# EasyEDA Pro project I2S_XLR_Adapter.eprj, schematic P1

## Sheets
1 DAC_XLR: Board Name: Board1; Create Date: 2026-01-31; Page Name: DAC_XLR; Project Name: I2S_XLR_Adapter; Schematic Name: P1; Update Date: 2026-05-29; Company: EasyEDA.com; Page Size: A4; Version: V1.0
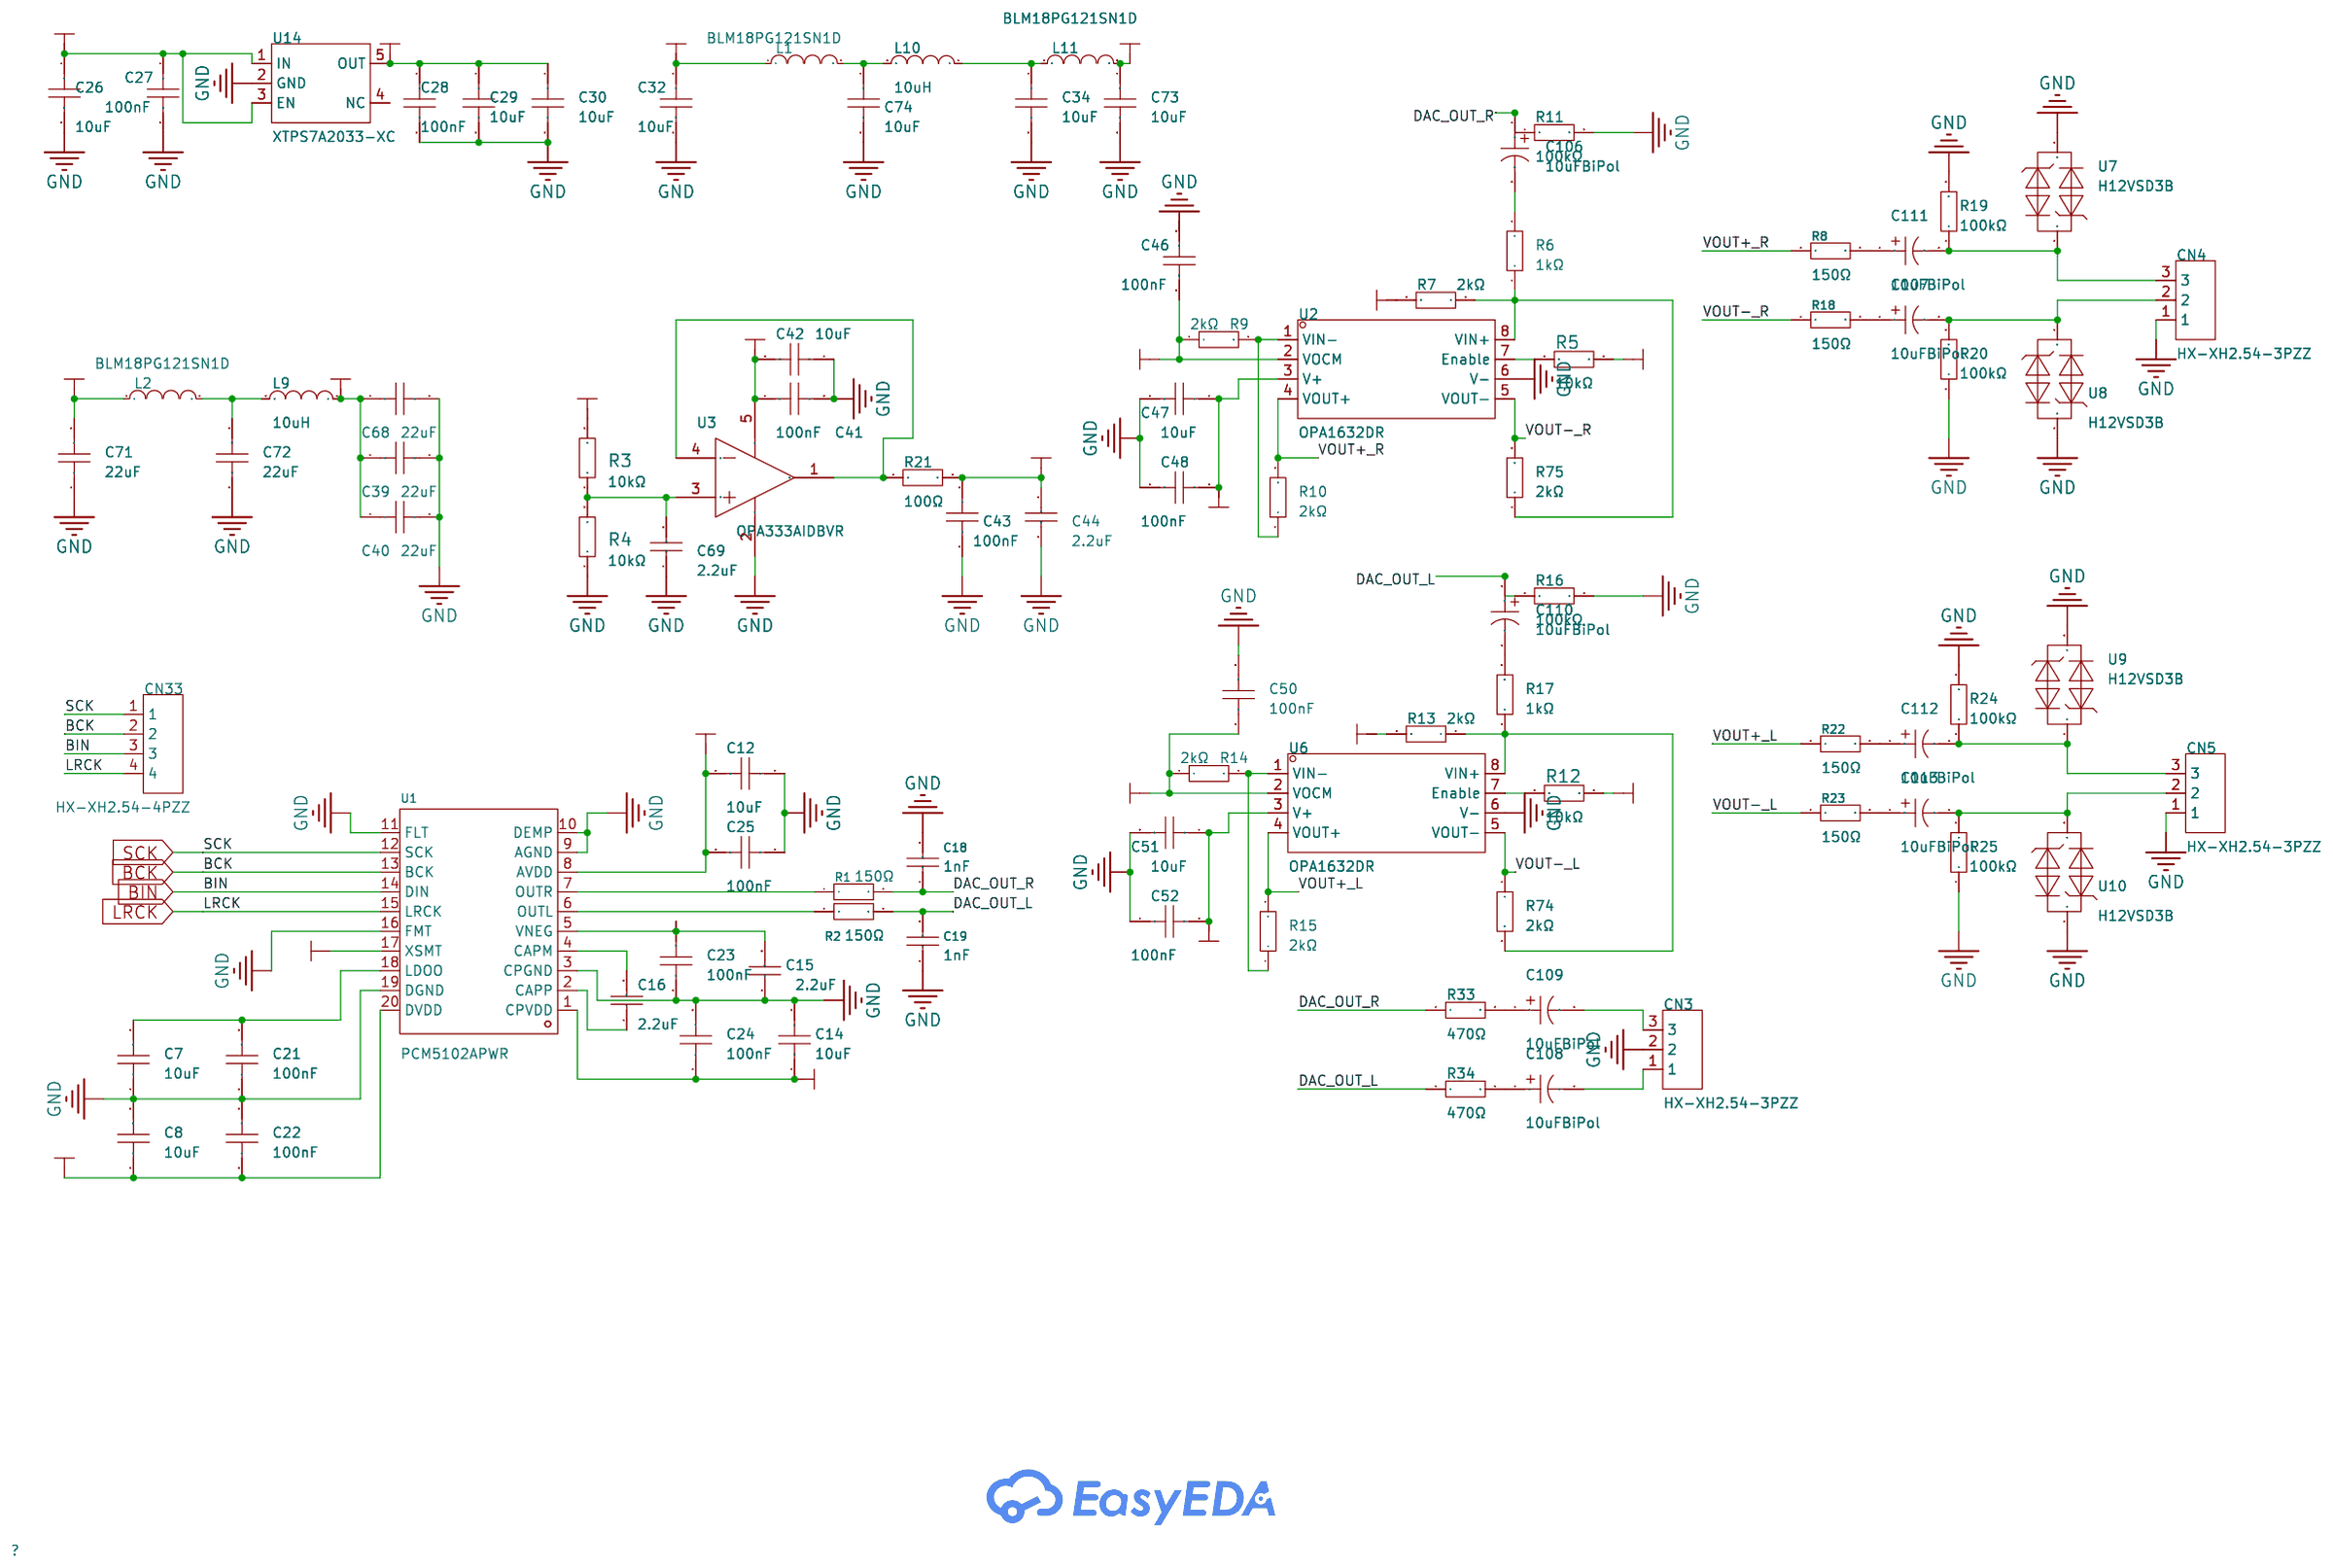
[diagram p0: DAC_XLR]
2 Power: Page Name: Power; Update Date: 2026-05-06
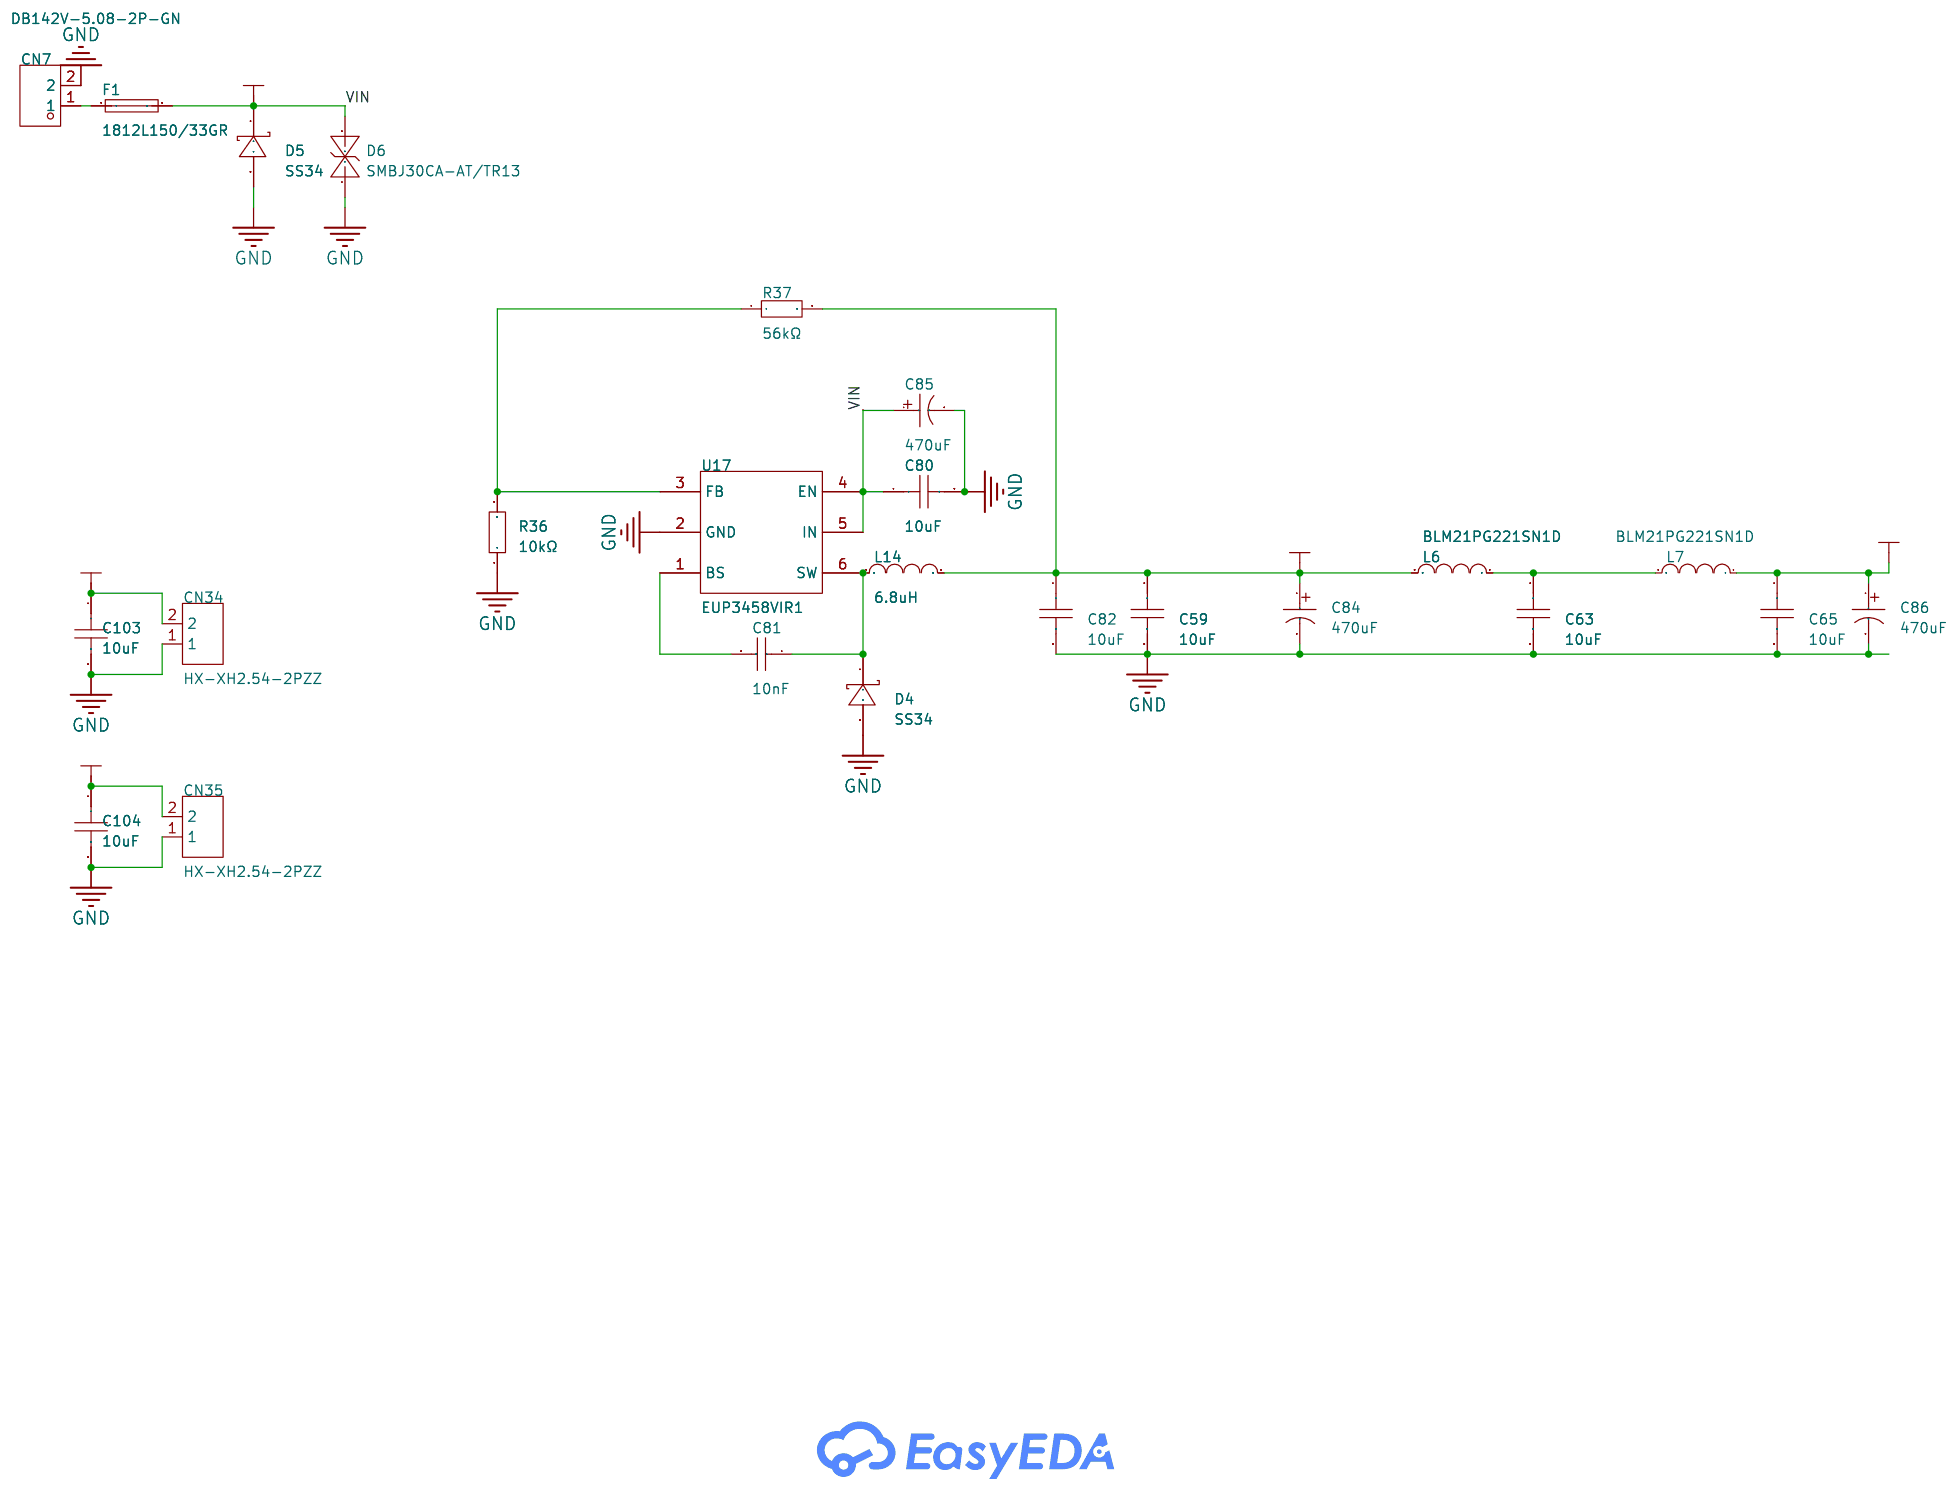
[diagram p1: Power]
3 MIDI: Create Date: 2026-02-01; Page Name: MIDI; Update Date: 2026-02-03
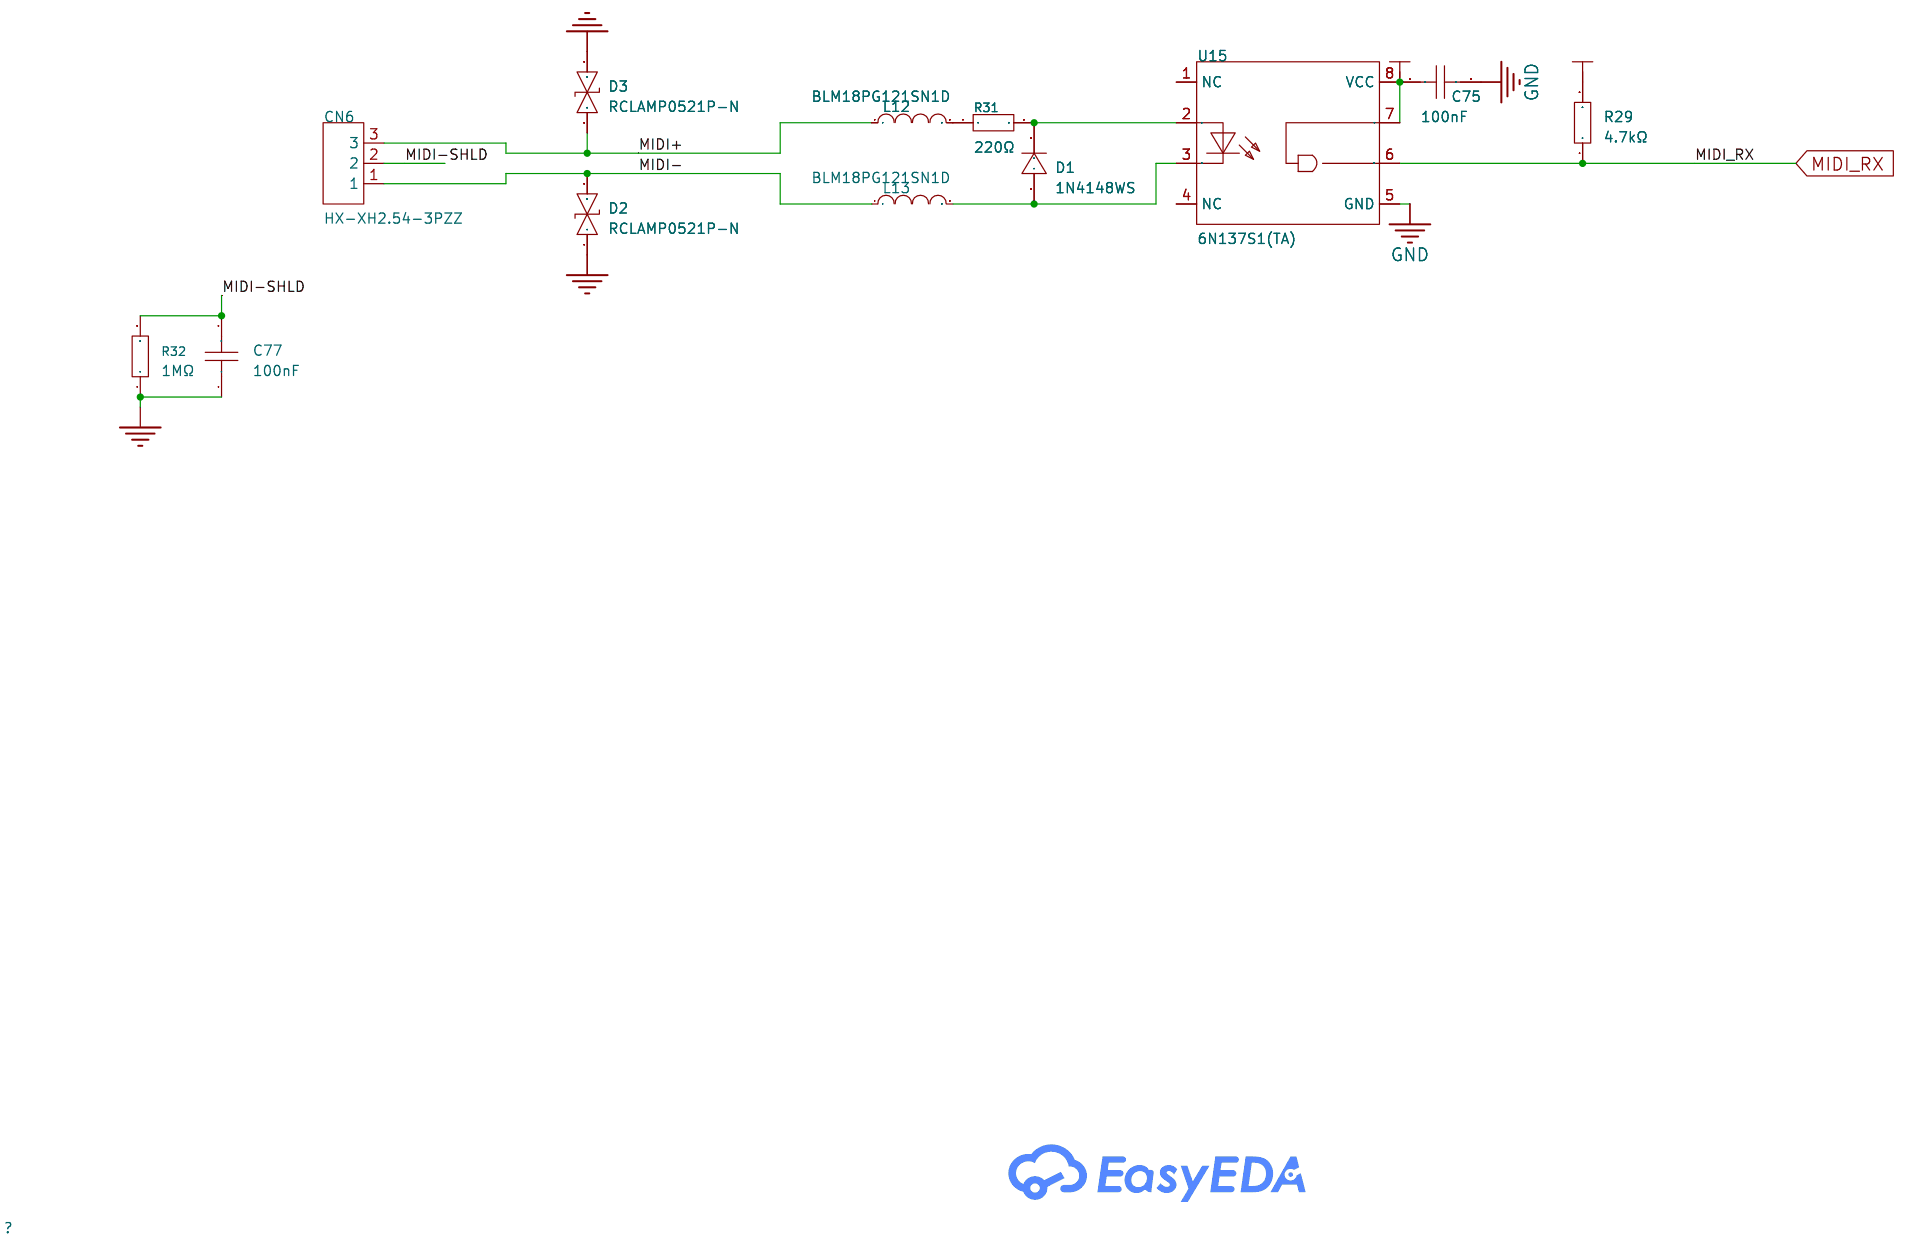
[diagram p2: MIDI]
4 ESP32: Create Date: 2026-05-05; Page Name: ESP32
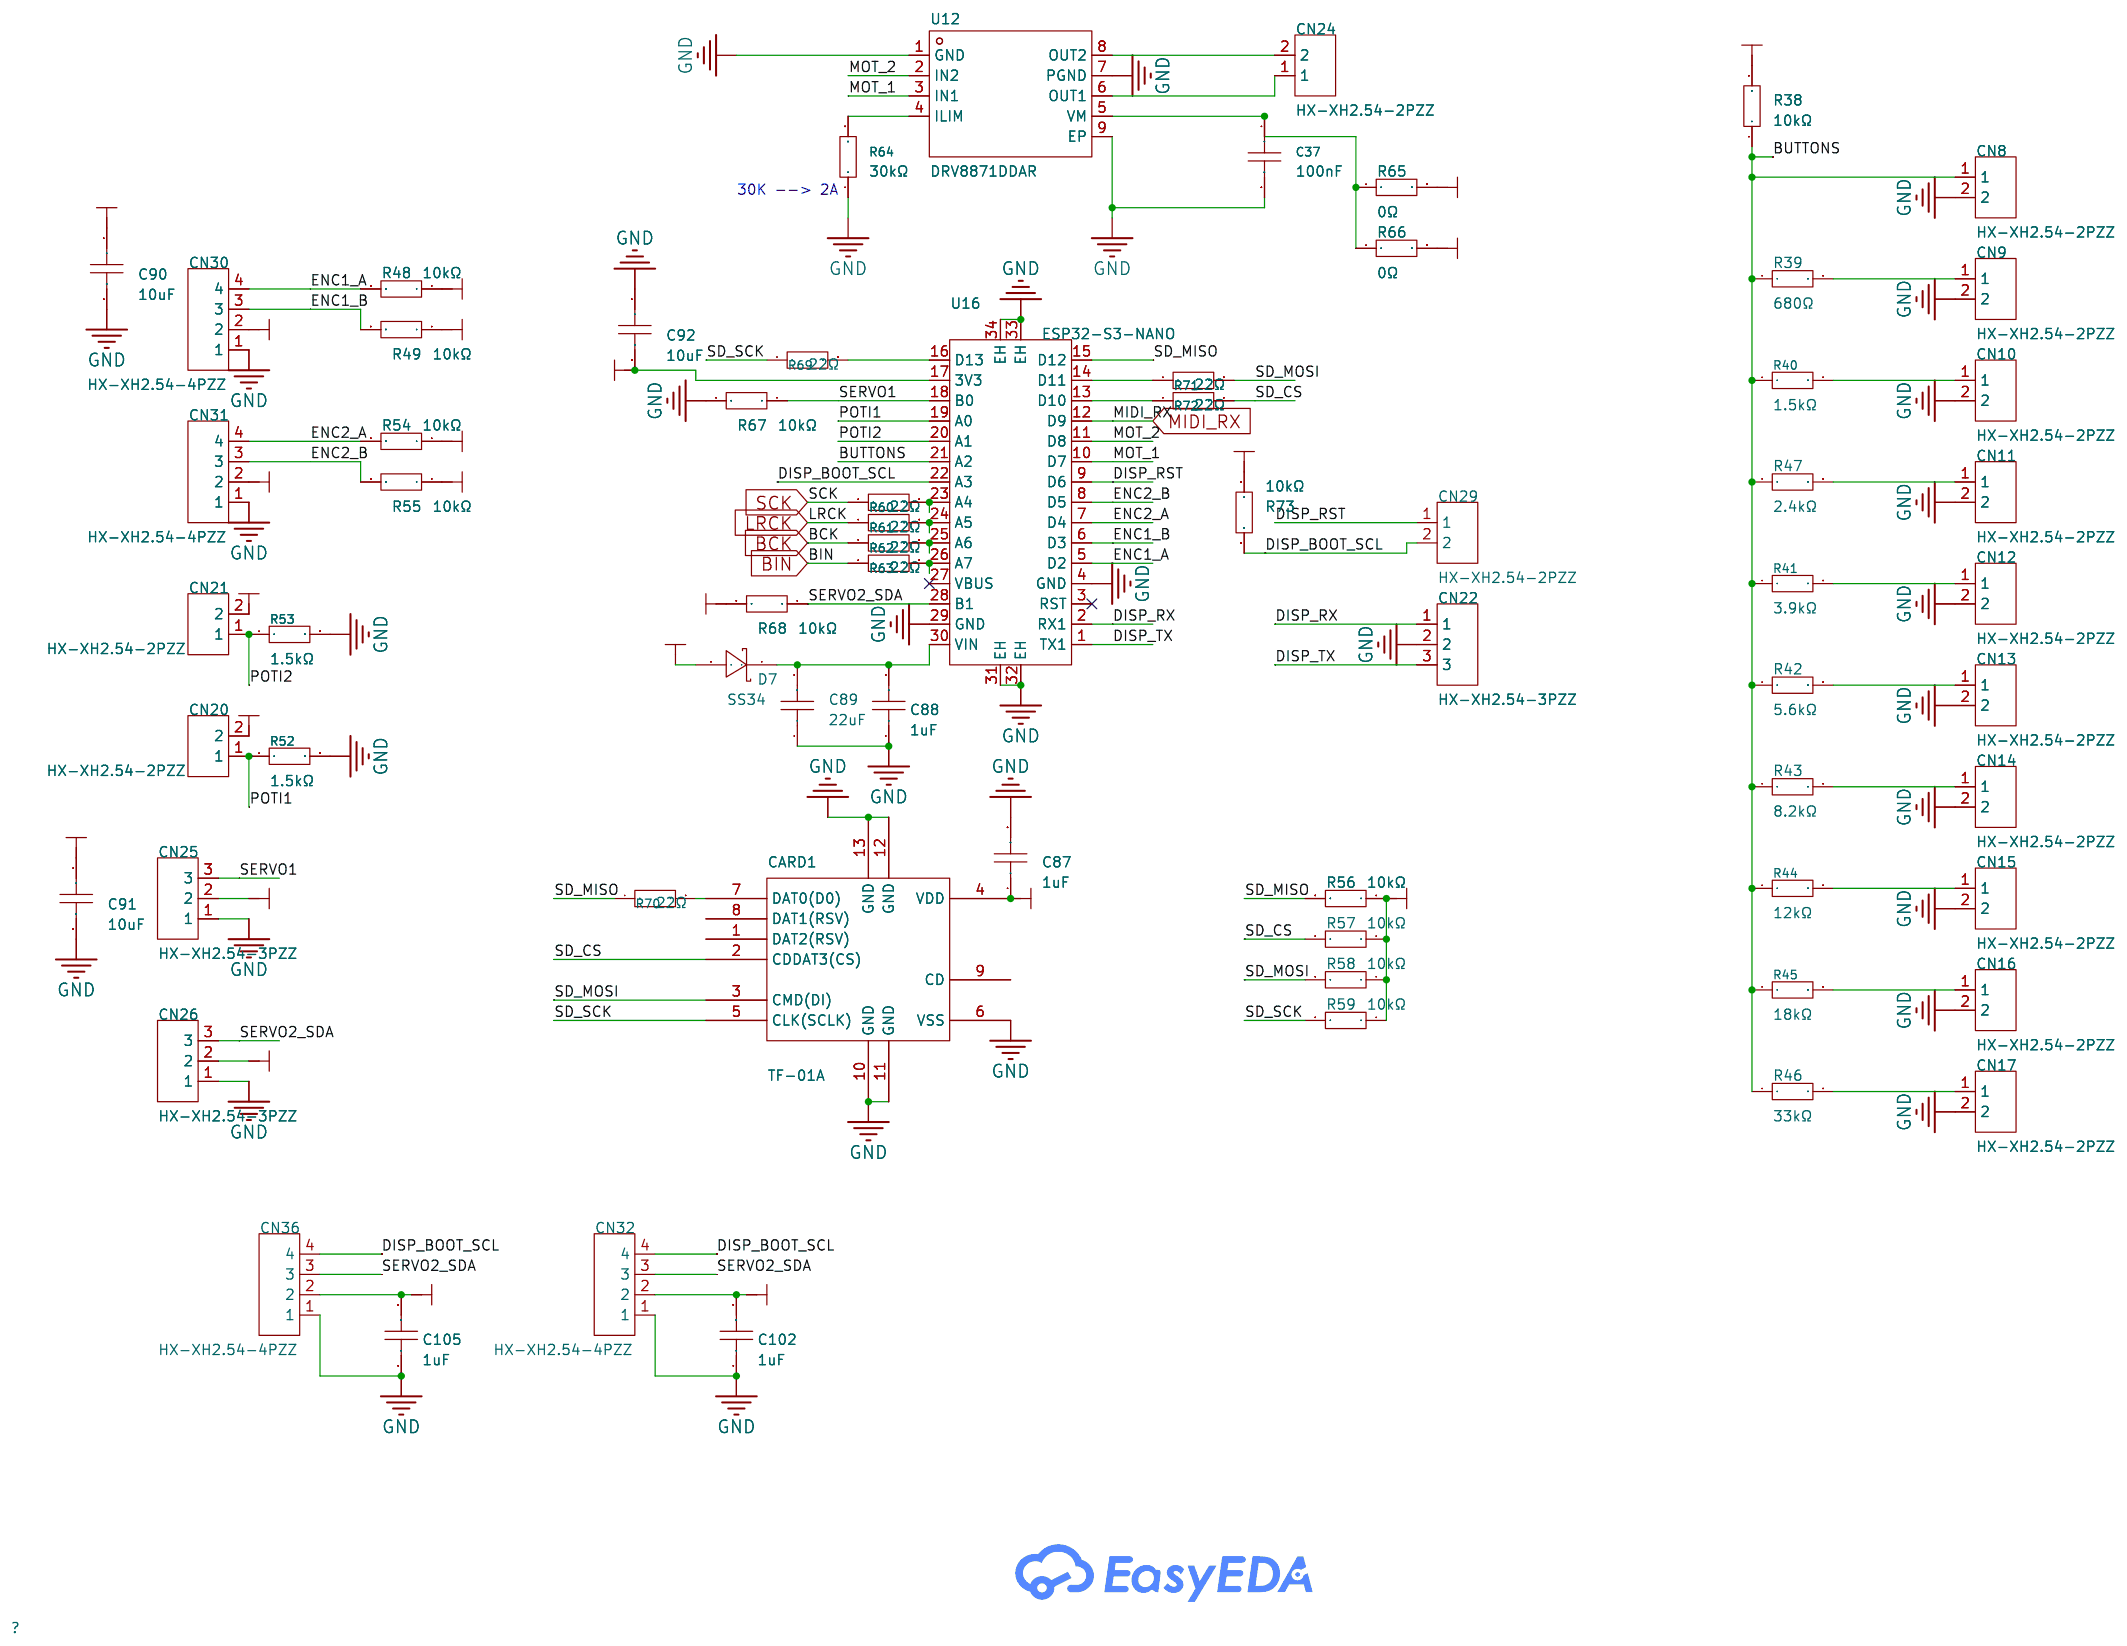
[diagram p3: ESP32]

## Parts
sheet DAC_XLR
C7  10uF  [C0805]
C8  10uF  [C0805]
C12  10uF  [C0805]
C14  10uF  [C0805]
C15  2.2uF  [C1206]
C16  2.2uF  [C1206]
C18  1nF  [C0603]
C19  1nF  [C0603]
C21  100nF  [C0402]
C22  100nF  [C0402]
C23  100nF  [C0402]
C24  100nF  [C0402]
C25  100nF  [C0402]
C26  10uF  [C0805]
C27  100nF  [C0402]
C28  100nF  [C0402]
C29  10uF  [C0805]
C30  10uF  [C0805]
C32  10uF  [C0805]
C34  10uF  [C0805]
C39  22uF  [C0805]
C40  22uF  [C0805]
C41  100nF  [C0402]
C42  10uF  [C0805]
C43  100nF  [C0402]
C44  2.2uF  [C1206]
C46  100nF  [C0402]
C47  10uF  [C0805]
C48  100nF  [C0402]
C50  100nF  [C0402]
C51  10uF  [C0805]
C52  100nF  [C0402]
C68  22uF  [C0805]
C69  2.2uF  [C1206]
C71  22uF  [C0805]
C72  22uF  [C0805]
C73  10uF  [C0805]
C74  10uF  [C0805]
C106  10uFBiPol  [CAP-TH_BD8.0-P3.50-D0.6-FD_1]  (no BOM)
C107  10uFBiPol  [CAP-TH_BD8.0-P3.50-D0.6-FD_1]  (no BOM)
C108  10uFBiPol  [CAP-TH_BD8.0-P3.50-D0.6-FD_1]  (no BOM)
C109  10uFBiPol  [CAP-TH_BD8.0-P3.50-D0.6-FD_1]  (no BOM)
C110  10uFBiPol  [CAP-TH_BD8.0-P3.50-D0.6-FD_1]  (no BOM)
C111  10uFBiPol  [CAP-TH_BD8.0-P3.50-D0.6-FD_1]  (no BOM)
C112  10uFBiPol  [CAP-TH_BD8.0-P3.50-D0.6-FD_1]  (no BOM)
C113  10uFBiPol  [CAP-TH_BD8.0-P3.50-D0.6-FD_1]  (no BOM)
CN3  HX-XH2.54-3PZZ  [CONN-TH_3P-P2.50_HC-XH-3A-G]
CN4  HX-XH2.54-3PZZ  [CONN-TH_3P-P2.50_HC-XH-3A-G]
CN5  HX-XH2.54-3PZZ  [CONN-TH_3P-P2.50_HC-XH-3A-G]
CN33  HX-XH2.54-4PZZ  [CONN-TH_4P-P2.50-XH2.54-4P]
L1  BLM18PG121SN1D  [L0603]
L2  BLM18PG121SN1D  [L0603]
L9  10uH  [IND-SMD_L2.5-W2.0]
L10  10uH  [IND-SMD_L2.5-W2.0]
L11  BLM18PG121SN1D  [L0603]
R1  150Ω  [R0603]
R2  150Ω  [R0603]
R3  10kΩ  [R0603]
R4  10kΩ  [R0603]
R5  10kΩ  [R0603]
R6  1kΩ  [R0603]
R7  2kΩ  [R0603]
R8  150Ω  [R0603]
R9  2kΩ  [R0603]
R10  2kΩ  [R0603]
R11  100kΩ  [R0603]
R12  10kΩ  [R0603]
R13  2kΩ  [R0603]
R14  2kΩ  [R0603]
R15  2kΩ  [R0603]
R16  100kΩ  [R0603]
R17  1kΩ  [R0603]
R18  150Ω  [R0603]
R19  100kΩ  [R0603]
R20  100kΩ  [R0603]
R21  100Ω  [R0402]
R22  150Ω  [R0603]
R23  150Ω  [R0603]
R24  100kΩ  [R0603]
R25  100kΩ  [R0603]
R33  470Ω  [R0603]
R34  470Ω  [R0603]
R74  2kΩ  [R0603]
R75  2kΩ  [R0603]
U1  PCM5102APWR  [TSSOP-20_L6.5-W4.4-P0.65-LS6.4-BL]
U2  OPA1632DR  [SOIC-8_L4.9-W3.9-P1.27-LS6.0-BL]
U3  OPA333AIDBVR  [SOT-23-5_L3.0-W1.7-P0.95-LS2.8-BR]
U6  OPA1632DR  [SOIC-8_L4.9-W3.9-P1.27-LS6.0-BL]
U7  H12VSD3B  [SOD-323_L1.8-W1.3-LS2.7-BI]
U8  H12VSD3B  [SOD-323_L1.8-W1.3-LS2.7-BI]
U9  H12VSD3B  [SOD-323_L1.8-W1.3-LS2.7-BI]
U10  H12VSD3B  [SOD-323_L1.8-W1.3-LS2.7-BI]
U14  XTPS7A2033-XC  [SOT-23-5_L3.0-W1.7-P0.95-LS2.8-BL]
sheet ESP32
C37  100nF  [C0603]
C87  1uF  [C0402]
C88  1uF  [C0402]
C89  22uF  [C0805]
C90  10uF  [C0805]
C91  10uF  [C0805]
C92  10uF  [C0805]
C102  1uF  [C0402]
C105  1uF  [C0402]
CARD1  TF-01A  [TF-SMD_TF-01A]
CN8  HX-XH2.54-2PZZ  [CONN-TH_2P-P2.50_HX-2.54MM-2P-ZZ-MS]
CN9  HX-XH2.54-2PZZ  [CONN-TH_2P-P2.50_HX-2.54MM-2P-ZZ-MS]
CN10  HX-XH2.54-2PZZ  [CONN-TH_2P-P2.50_HX-2.54MM-2P-ZZ-MS]
CN11  HX-XH2.54-2PZZ  [CONN-TH_2P-P2.50_HX-2.54MM-2P-ZZ-MS]
CN12  HX-XH2.54-2PZZ  [CONN-TH_2P-P2.50_HX-2.54MM-2P-ZZ-MS]
CN13  HX-XH2.54-2PZZ  [CONN-TH_2P-P2.50_HX-2.54MM-2P-ZZ-MS]
CN14  HX-XH2.54-2PZZ  [CONN-TH_2P-P2.50_HX-2.54MM-2P-ZZ-MS]
CN15  HX-XH2.54-2PZZ  [CONN-TH_2P-P2.50_HX-2.54MM-2P-ZZ-MS]
CN16  HX-XH2.54-2PZZ  [CONN-TH_2P-P2.50_HX-2.54MM-2P-ZZ-MS]
CN17  HX-XH2.54-2PZZ  [CONN-TH_2P-P2.50_HX-2.54MM-2P-ZZ-MS]
CN20  HX-XH2.54-2PZZ  [CONN-TH_2P-P2.50_HX-2.54MM-2P-ZZ-MS]
CN21  HX-XH2.54-2PZZ  [CONN-TH_2P-P2.50_HX-2.54MM-2P-ZZ-MS]
CN22  HX-XH2.54-3PZZ  [CONN-TH_3P-P2.50_HC-XH-3A-G]
CN24  HX-XH2.54-2PZZ  [CONN-TH_2P-P2.50_HX-2.54MM-2P-ZZ-MS]
CN25  HX-XH2.54-3PZZ  [CONN-TH_3P-P2.50_HC-XH-3A-G]
CN26  HX-XH2.54-3PZZ  [CONN-TH_3P-P2.50_HC-XH-3A-G]
CN29  HX-XH2.54-2PZZ  [CONN-TH_2P-P2.50_HX-2.54MM-2P-ZZ-MS]
CN30  HX-XH2.54-4PZZ  [CONN-TH_4P-P2.50-XH2.54-4P]
CN31  HX-XH2.54-4PZZ  [CONN-TH_4P-P2.50-XH2.54-4P]
CN32  HX-XH2.54-4PZZ  [CONN-TH_4P-P2.50-XH2.54-4P]
CN36  HX-XH2.54-4PZZ  [CONN-TH_4P-P2.50-XH2.54-4P]
D7  SS34  [SMA_L4.3-W2.6-LS5.2-RD]
R38  10kΩ  [R0402]
R39  680Ω  [R0402]
R40  1.5kΩ  [R0402]
R41  3.9kΩ  [R0402]
R42  5.6kΩ  [R0402]
R43  8.2kΩ  [R0402]
R44  12kΩ  [R0402]
R45  18kΩ  [R0402]
R46  33kΩ  [R0402]
R47  2.4kΩ  [R0402]
R48  10kΩ  [R0402]
R49  10kΩ  [R0402]
R52  1.5kΩ  [R0402]
R53  1.5kΩ  [R0402]
R54  10kΩ  [R0402]
R55  10kΩ  [R0402]
R56  10kΩ  [R0402]
R57  10kΩ  [R0402]
R58  10kΩ  [R0402]
R59  10kΩ  [R0402]
R60  22Ω  [R0402]
R61  22Ω  [R0402]
R62  22Ω  [R0402]
R63  22Ω  [R0402]
R64  30kΩ  [R0603]
R65  0Ω  [R0805]
R66  0Ω  [R0805]  (no BOM)
R67  10kΩ  [R0402]
R68  10kΩ  [R0402]
R69  22Ω  [R0402]
R70  22Ω  [R0402]
R71  22Ω  [R0402]
R72  22Ω  [R0402]
R73  10kΩ  [R0402]
U12  DRV8871DDAR  [SO-8_L4.9-W3.9-P1.27-LS6.0-BL-EP]
U16  ESP32-S3-NANO  [COMM-TH_43.2-W17.8-P2.54_ESP32-S3]
sheet MIDI
C75  100nF  [C0402]
C77  100nF  [C0402]
CN6  HX-XH2.54-3PZZ  [CONN-TH_3P-P2.50_HC-XH-3A-G]
D1  1N4148WS  [SOD-323_L1.8-W1.3-LS2.5-RD]
D2  RCLAMP0521P-N  [X1-DFN1006-2_L1.0-W0.6-P0.65-BI]
D3  RCLAMP0521P-N  [X1-DFN1006-2_L1.0-W0.6-P0.65-BI]
L12  BLM18PG121SN1D  [L0603]
L13  BLM18PG121SN1D  [L0603]
R29  4.7kΩ  [R0603]
R31  220Ω  [R0603]
R32  1MΩ  [R0603]
U15  6N137S1(TA)  [SMD-8_L9.8-W6.6-P2.54-LS10.3-BL]
sheet Power
C59  10uF  [C0805]
C63  10uF  [C0805]
C65  10uF  [C0805]
C80  10uF  [C0805]
C81  10nF  [C0402]
C82  10uF  [C0805]
C84  470uF  [CAP-TH_BD10.0-P5.00-D1.0-FD]
C85  470uF  [CAP-TH_BD10.0-P5.00-D1.0-FD]
C86  470uF  [CAP-TH_BD10.0-P5.00-D1.0-FD]
C103  10uF  [C0805]
C104  10uF  [C0805]
CN7  DB142V-5.08-2P-GN  [CONN-TH_2P-P5.08_DIBO_DB142V-5.08-2P]
CN34  HX-XH2.54-2PZZ  [CONN-TH_2P-P2.50_HX-2.54MM-2P-ZZ-MS]
CN35  HX-XH2.54-2PZZ  [CONN-TH_2P-P2.50_HX-2.54MM-2P-ZZ-MS]
D4  SS34  [SMA_L4.3-W2.6-LS5.2-RD]
D5  SS34  [SMA_L4.3-W2.6-LS5.2-RD]
D6  SMBJ30CA-AT/TR13  [SMB_L4.3-W3.6-LS5.4-BI]
F1  1812L150/33GR  [F1812]
L6  BLM21PG221SN1D  [L0805]
L7  BLM21PG221SN1D  [L0805]
L14  6.8uH  [IND-SMD_L7.0-W6.6]
R36  10kΩ  [R0402]
R37  56kΩ  [R0402]
U17  EUP3458VIR1  [SOT-23-6_L2.9-W1.6-P0.95-LS2.8-BL]

## Library data of the parts
C7 C8 C12 C14 C26 C29 C30 C32 C34 C42 C47 C51 C59 C63 C65 C73 C74 C80 C82 C90-C92 C103 C104 = CL21A106KAYNNNE_C15850: LCSC Part Name: 10uF ±10% 25V; Supplier Part: C15850; Manufacturer: SAMSUNG(三星); Manufacturer Part: CL21A106KAYNNNE; Supplier Footprint: 0805; JLCPCB Part Class: Basic Part; Datasheet: https://item.szlcsc.com/datasheet/CL21A106KAYNNNE/16532.html; Supplier: LCSC; Tolerance: ±10%; Voltage Rating: 25V; Temperature Coefficient: X5R
C15 C16 C44 C69 = CL31B225KBHNNNE: LCSC Part Name: 2.2uF ±10% 50V; Supplier Part: C50254; Manufacturer: SAMSUNG(三星); Supplier Footprint: 1206; JLCPCB Part Class: Basic Part; Datasheet: https://item.szlcsc.com/datasheet/CL31B225KBHNNNE/51263.html; Supplier: LCSC; Tolerance: ±10%; Voltage Rating: 50V; Temperature Coefficient: X7R
C18 C19 = CL10B102KB8NNNC: LCSC Part Name: 1nF ±10% 50V; Supplier Part: C1588; Manufacturer: SAMSUNG(三星); Supplier Footprint: 0603; JLCPCB Part Class: Basic Part; Datasheet: https://item.szlcsc.com/datasheet/CL10B102KB8NNNC/1940.html; Supplier: LCSC; Tolerance: ±10%; Voltage Rating: 50V; Temperature Coefficient: X7R
C21-C25 C27 C28 C41 C43 C46 C48 C50 C52 C75 C77 = CL05B104KB54PNC: LCSC Part Name: 100nF ±10% 50V; Supplier Part: C307331; Manufacturer: SAMSUNG(三星); Supplier Footprint: 0402; JLCPCB Part Class: Basic Part; Datasheet: https://item.szlcsc.com/datasheet/CL05B104KB54PNC/291005.html; Supplier: LCSC; Tolerance: ±10%; Voltage Rating: 50V; Temperature Coefficient: X7R
C39 C40 C68 C71 C72 C89 = CL21A226MAQNNNE: LCSC Part Name: 22uF ±20% 25V; Supplier Part: C45783; Manufacturer: SAMSUNG(三星); Supplier Footprint: 0805; JLCPCB Part Class: Basic Part; Datasheet: https://item.szlcsc.com/datasheet/CL21A226MAQNNNE/46786.html; Supplier: LCSC; Tolerance: ±20%; Voltage Rating: 25V; Temperature Coefficient: X5R
C106-C113 = UES1C470MPM: LCSC Part Name: 47uF ±20% 16V; Supplier Part: C1669286; Manufacturer: Nichicon(尼吉康); Supplier Footprint: 插件,D8xL11.5mm; JLCPCB Part Class: Extended Part; Datasheet: https://item.szlcsc.com/datasheet/UES1C470MPM/1760135.html; Supplier: LCSC; Tolerance: ±20%; Voltage Rating: 16V; Pin Spacing: 3.5mm; Diameter: 8mm; Height - Seated (Max): 11.5mm; Polarity type: 无极性
CN3-CN6 CN22 CN25 CN26 = HX-XH2.54-3PZZ: LCSC Part Name: 1x3P 间距:2.54mm 直插 系列:XH; Supplier Part: C42391661; Manufacturer: hanxia(韩下); Supplier Footprint: 插件,P=2.5mm; JLCPCB Part Class: Extended Part; Datasheet: https://item.szlcsc.com/datasheet/HX-XH2.54-3PZZ/44326933.html; Supplier: LCSC; Pins Structure: 1x3P; Pitch: 2.54mm; Mounting Type: Through Hole; Reference Series: XH; Number of Pins: 3P; Number of Rows: 1; Number of PINs Per Row: 3; Current Rating: 3A; Contact Material: Brass; Contact Plating: Tin; Operating Temperature: -25℃~+85℃; Voltage Rating: 250V; Plastic Material: PA66; Flame Retardant Rating: UL94V-0; Color: White
CN30-CN33 CN36 = HX-XH2.54-4PZZ: LCSC Part Name: 1x4P 间距:2.54mm 直插 系列:XH; Supplier Part: C42391662; Manufacturer: hanxia(韩下); Supplier Footprint: 插件,P=2.5mm; JLCPCB Part Class: Extended Part; Datasheet: https://item.szlcsc.com/datasheet/HX-XH2.54-4PZZ/44326934.html; Supplier: LCSC; Pins Structure: 1x4P; Pitch: 2.54mm; Mounting Type: Through Hole; Reference Series: XH; Number of Pins: 4P; Number of Rows: 1; Number of PINs Per Row: 4; Current Rating: 3A; Contact Material: Brass; Contact Plating: Tin; Operating Temperature: -25℃~+85℃; Voltage Rating: 250V; Plastic Material: PA66; Flame Retardant Rating: UL94V-0; Color: White
L1 L2 L11-L13 = BLM18PG121SN1D_C14709: LCSC Part Name: 单路 0603磁珠 阻抗120Ω@100MHz; Supplier Part: C14709; Manufacturer: muRata(村田); Supplier Footprint: 0603; JLCPCB Part Class: Basic Part; Datasheet: https://item.szlcsc.com/datasheet/BLM18PG121SN1D/15379.html; Supplier: LCSC; Impedance @ Frequency: 120Ω@100MHz; Tolerance: ±25%; DC Resistance(DCR): 50mΩ; Current Rating: 2A; Number of Circuits: 1; Operating Temperature: -55℃~+125℃
L9 L10 = FTC252012S100MBCA: LCSC Part Name: 10uH ±20% 1.6A; Supplier Part: C5832376; Manufacturer: cjiang(长江微电); Supplier Footprint: SMD,2x2.5mm; JLCPCB Part Class: Extended Part; Datasheet: https://atta.szlcsc.com/upload/public/pdf/source/20230602/8FFEDA9C0247A92A0D4B67554BFE4091.pdf; Supplier: LCSC; Tolerance: ±20%; Saturation Current (Isat): 1.6A; Type: 一体成型电感
R1 R2 R8 R18 R22 R23 = 0603WAF1500T5E: LCSC Part Name: 150Ω ±1% 100mW 厚膜电阻; Supplier Part: C22808; Manufacturer: UNI-ROYAL(厚声); Supplier Footprint: 0603; JLCPCB Part Class: Basic Part; Datasheet: https://atta.szlcsc.com/upload/public/pdf/source/20200306/C422600_1E6D84923E4A46A82E41ADD87F860B5C.pdf; Supplier: LCSC; Type: Thick Film Resistors; Tolerance: ±1%; Temperature Coefficient: ±100ppm/℃; Operating Temperature Range: -55℃~+155℃
R3-R5 R12 = 0603WAF1002T5E: LCSC Part Name: 厚膜电阻 10kΩ ±1% 100mW; Supplier Part: C25804; Manufacturer: UNI-ROYAL(厚声); Supplier Footprint: 0603; JLCPCB Part Class: Basic Part; Datasheet: https://item.szlcsc.com/datasheet/0603WAF1002T5E/26547.html; Supplier: LCSC; Type: Thick Film Resistor; Tolerance: ±1%; Power(Watts): 100mW; Voltage-Supply(Max): 75V; Temperature Coefficient: ±100ppm/℃; Operating Temperature: -55℃~+155℃
R6 R17 = 0603WAF1001T5E: LCSC Part Name: 1kΩ ±1% 100mW 厚膜电阻; Supplier Part: C21190; Manufacturer: UNI-ROYAL(厚声); Supplier Footprint: 0603; JLCPCB Part Class: Basic Part; Datasheet: https://item.szlcsc.com/datasheet/0603WAF1001T5E/21904.html; Supplier: LCSC; Type: Thick Film Resistor; Tolerance: ±1%; Power(Watts): 100mW; Voltage-Supply(Max): 75V; Temperature Coefficient: ±100ppm/℃; Operating Temperature: -55℃~+155℃
R7 R9 R10 R13-R15 R74 R75 = 0603WAF2001T5E: LCSC Part Name: 2kΩ ±1% 100mW 厚膜电阻; Supplier Part: C22975; Manufacturer: UNI-ROYAL(厚声); Supplier Footprint: 0603; JLCPCB Part Class: Basic Part; Datasheet: https://item.szlcsc.com/datasheet/0603WAF2001T5E/23702.html; Supplier: LCSC; Type: Thick Film Resistor; Tolerance: ±1%; Power(Watts): 100mW; Voltage-Supply(Max): 75V; Temperature Coefficient: ±100ppm/℃; Operating Temperature: -55℃~+155℃
R11 R16 R19 R20 R24 R25 = 0603WAF1003T5E: LCSC Part Name: 100kΩ ±1% 100mW 厚膜电阻; Supplier Part: C25803; Manufacturer: UNI-ROYAL(厚声); Supplier Footprint: 0603; JLCPCB Part Class: Basic Part; Datasheet: https://item.szlcsc.com/datasheet/0603WAF1003T5E/26546.html; Supplier: LCSC; Type: Thick Film Resistor; Tolerance: ±1%; Power(Watts): 100mW; Voltage-Supply(Max): 75V; Temperature Coefficient: ±100ppm/℃; Operating Temperature: -55℃~+155℃
R21 = 0402WGF1000TCE: LCSC Part Name: 100Ω ±1% 62.5mW 厚膜电阻; Supplier Part: C25076; Manufacturer: UNI-ROYAL(厚声); Supplier Footprint: 0402; JLCPCB Part Class: Basic Part; Datasheet: https://atta.szlcsc.com/upload/public/pdf/source/20200306/C422600_1E6D84923E4A46A82E41ADD87F860B5C.pdf; Supplier: LCSC; Type: Thick Film Resistors; Tolerance: ±1%; Temperature Coefficient: ±200ppm/℃; Operating Temperature Range: -55℃~+155℃
R33 R34 = 0603WAF4700T5E: LCSC Part Name: 470Ω ±1% 100mW 厚膜电阻; Supplier Part: C23179; Manufacturer: UNI-ROYAL(厚声); Supplier Footprint: 0603; JLCPCB Part Class: Basic Part; Datasheet: https://item.szlcsc.com/datasheet/0603WAF4700T5E/23906.html; Supplier: LCSC; Type: Thick Film Resistor; Tolerance: ±1%; Power(Watts): 100mW; Voltage-Supply(Max): 75V; Temperature Coefficient: ±100ppm/℃; Operating Temperature: -55℃~+155℃
U1 = PCM5102APWR: Supplier Part: C107671; Manufacturer: TI(德州仪器); Supplier Footprint: TSSOP-20; JLCPCB Part Class: Extended Part; Datasheet: https://www.ti.com/cn/lit/gpn/pcm5102a; Supplier: LCSC; Interface Type: PCM; Supply Voltage: 1.65V~3.46V; Number of Channels: 2; Resolution: 24；16；32; Operating Temperature: -25℃~+85℃
U2 U6 = OPA1632DR: LCSC Part Name: 高性能、全差分音频运算放大器 OPA1632; Supplier Part: C86715; Manufacturer: TI(德州仪器); Supplier Footprint: SOIC-8; JLCPCB Part Class: Extended Part; Datasheet: https://www.ti.com/cn/lit/gpn/opa1632; Supplier: LCSC; Speaker Channels: 1-Channel; Operating Temperature: -40℃~+85℃
U3 = OPA333AIDBVR: LCSC Part Name: OPAx333 1.8V微功耗CMOS运算放大器零漂移系列; Supplier Part: C30878; Manufacturer: TI(德州仪器); Supplier Footprint: SOT-23-5; JLCPCB Part Class: Extended Part; Datasheet: https://www.ti.com/cn/lit/gpn/opa333; Supplier: LCSC; Number of Channels: 1; Gain Bandwidth Product: 350kHz; Ib - Input Bias Current: 70pA; Vos - Input Offset Voltage: 2uV; Common Mode Rejection Ratio(CMRR): 130dB; Slew Rate: 0.16V/us; Output Current: 5mA; Rail to Rail: Rail-to-Rail Input, Rail-to-Rail Output; Input Offset Voltage Drift(Vos TC): 50nV/℃; Quiescent Current(Iq): 17uA; Operating Temperature: -40℃~+125℃; Single Supply: 1.8V~5.5V; Dual Supply: 900mV~2.75V；-2.75V~-900mV; Maximum Power Supply Range (Vdd-Vss): 5.5V; Input Offset Current(Ios): 400pA
U7-U10 = H12VSD3B: LCSC Part Name: 丝印:ABLC 双向ESD 12V截止 峰值浪涌电流：20A@8/20us; Supplier Part: C20615811; Manufacturer: R+O(宏嘉诚); Supplier Footprint: SOD-323; JLCPCB Part Class: Extended Part; Datasheet: https://item.szlcsc.com/datasheet/H12VSD3B/21979986.html; Supplier: LCSC; Polarity: Bidirectional; Reverse Stand-Off Voltage (Vrwm): 12V; Clamping Voltage: 20V；32V；28V; Peak Pulse Current (Ipp): 20A@8/20us; Peak Pulse Power Dissipation (Ppp): 640W@8/20us; Voltage - Breakdown: 16.5V; Reverse Leakage Current (Ir): 1uA; Operating Temperature: -55℃~+125℃; level of protection: IEC 61000-4-5；IEC 61000-4-2; Type: ESD; Junction Capacitance: 1.5pF
U14 = XTPS7A2033-XC: LCSC Part Name: 3.3V 300mA 5.5V; Supplier Part: C51953290; Manufacturer: SiChange(芯昌科技); Supplier Footprint: SOT-23-5; JLCPCB Part Class: Extended Part; Datasheet: https://item.szlcsc.com/datasheet/XTPS7A2033-XC/54680474.html; Supplier: LCSC; Output Type: Fixed; Voltage - Supply: 5.5V; Output Voltage: 3.3V; Output Current: 300mA; Power Supply Rejection Ratio (PSRR): 62dB@(1kHz); Voltage Dropout: 160mV@(300mA); standby current: 15uA; Noise: 9uVrms; Features: Over Current Protection；Enable；Over Temperature Protection; Operating Temperature: -40℃~+125℃; Output Configuration: Positive; Number of Outputs: 1
C37 = CC0603KRX7R9BB104: Capacitance: Tolerance:±10% Tolerance:±10% Voltage Rated: Temperature Coefficient:; LCSC Part Name: 100nF ±10% 50V; Supplier Part: C14663; Manufacturer: YAGEO(国巨); Supplier Footprint: 0603; JLCPCB Part Class: Basic Part; Datasheet: https://atta.szlcsc.com/upload/public/pdf/source/20180910/C282072_33301C7F631E79921B82A8DAC6BCC5B3.pdf; Supplier: LCSC; Tolerance: ±10%
C87 C88 C102 C105 = CL05A105KA5NQNC: LCSC Part Name: 1uF ±10% 25V; Supplier Part: C52923; Manufacturer: SAMSUNG(三星); Supplier Footprint: 0402; JLCPCB Part Class: Basic Part; Datasheet: https://item.szlcsc.com/datasheet/CL05A105KA5NQNC/53938.html; Supplier: LCSC; Tolerance: ±10%; Voltage Rating: 25V; Temperature Coefficient: X5R
CARD1 = TF-01A_C91145: LCSC Part Name: 自弹式 MicroSD卡(TF卡) 卡座; Supplier Part: C91145; Manufacturer: 韩国韩荣; Supplier Footprint: SMD; JLCPCB Part Class: Extended Part; Datasheet: https://item.szlcsc.com/datasheet/TF-01A/92334.html; Supplier: LCSC; Card Connection Mode: Push-Push; Card Type: MicroSD Card (TF Card); Connector Type: Connector and Ejector; Supplementary Features: With Locating Post; Height Above Board: 1.85mm
CN8-CN17 CN20 CN21 CN24 CN29 CN34 CN35 = HX-XH2.54-2PZZ: LCSC Part Name: 1x2P 间距:2.5mm 直插 系列:XH; Supplier Part: C42391660; Manufacturer: hanxia(韩下); Supplier Footprint: 插件,P=2.5mm; JLCPCB Part Class: Extended Part; Datasheet: https://item.szlcsc.com/datasheet/HX-XH2.54-2PZZ/44326932.html; Supplier: LCSC; Pins Structure: 1x2P; Pitch: 2.54mm; Mounting Type: Straight; Reference Series: XH; Number of Pins: 2P; Number of Rows: 1; Number of PINs Per Row: 2; Current Rating: 3A; Contact Material: Brass; Contact Plating: Tin; Operating Temperature: -25℃~+85℃; Voltage Rating: 250V; Plastic Material: PA66; Flame Retardant Rating: UL94V-0; Color: White
D4 D5 D7 = SS34_C8678: LCSC Part Name: 电压:40V 电流:3A; Supplier Part: C8678; Manufacturer: MDD(辰达半导体); Supplier Footprint: SMA(DO-214AC); JLCPCB Part Class: Basic Part; Datasheet: https://item.szlcsc.com/datasheet/SS34/9178.html; Supplier: LCSC; Diode Configuration: Independent; Voltage - Forward(Vf@If): 550mV@3A; Voltage - DC Reverse(Vr): 40V; Current - Rectified: 3A; Reverse Leakage Current (Ir): 500uA@40V; Operating Junction Temperature Range: -55℃~+125℃
R36 R38 R48 R49 R54-R59 R67 R68 R73 = 0402WGF1002TCE: LCSC Part Name: 10kΩ ±1% 62.5mW 厚膜电阻; Supplier Part: C25744; Manufacturer: UNI-ROYAL(厚声); Supplier Footprint: 0402; JLCPCB Part Class: Basic Part; Datasheet: https://item.szlcsc.com/datasheet/0402WGF1002TCE/26487.html; Supplier: LCSC; Type: Thick Film Resistor; Tolerance: ±1%; Power(Watts): 62.5mW; Voltage-Supply(Max): 50V; Temperature Coefficient: ±100ppm/℃; Operating Temperature: -55℃~+155℃
R39 = 0402WGF6800TCE: LCSC Part Name: 680Ω ±1% 62.5mW 厚膜电阻; Supplier Part: C25130; Manufacturer: UNI-ROYAL(厚声); Supplier Footprint: 0402; JLCPCB Part Class: Extended Part; Datasheet: https://item.szlcsc.com/datasheet/0402WGF6800TCE/25873.html; Supplier: LCSC; Type: Thick Film Resistor; Tolerance: ±1%; Power(Watts): 62.5mW; Voltage-Supply(Max): 50V; Temperature Coefficient: ±100ppm/℃; Operating Temperature: -55℃~+155℃
R40 R52 R53 = 0402WGF1501TCE: LCSC Part Name: 1.5kΩ ±1% 62.5mW 厚膜电阻; Supplier Part: C25867; Manufacturer: UNI-ROYAL(厚声); Supplier Footprint: 0402; JLCPCB Part Class: Basic Part; Datasheet: https://atta.szlcsc.com/upload/public/pdf/source/20200306/C422600_1E6D84923E4A46A82E41ADD87F860B5C.pdf; Supplier: LCSC; Type: Thick Film Resistors; Tolerance: ±1%; Temperature Coefficient: ±100ppm/℃; Operating Temperature Range: -55℃~+155℃
R41 = 0402WGJ0392TCE_C11925: LCSC Part Name: 3.9kΩ ±5% 62.5mW 厚膜电阻; Supplier Part: C11925; Manufacturer: UNI-ROYAL(厚声); Manufacturer Part: 0402WGJ0392TCE; Supplier Footprint: 0402; JLCPCB Part Class: Extended Part; Datasheet: https://item.szlcsc.com/datasheet/0402WGJ0392TCE/12479.html; Supplier: LCSC; Type: Thick Film Resistor; Tolerance: ±5%; Power(Watts): 62.5mW; Voltage-Supply(Max): 50V; Temperature Coefficient: ±100ppm/℃; Operating Temperature: -55℃~+155℃
R42 = 0402WGF5601TCE: LCSC Part Name: 5.6kΩ ±1% 62.5mW 厚膜电阻; Supplier Part: C25908; Manufacturer: UNI-ROYAL(厚声); Supplier Footprint: 0402; JLCPCB Part Class: Extended Part; Datasheet: https://atta.szlcsc.com/upload/public/pdf/source/20200306/C422600_1E6D84923E4A46A82E41ADD87F860B5C.pdf; Supplier: LCSC; Type: Thick Film Resistors; Tolerance: ±1%; Temperature Coefficient: ±100ppm/℃; Operating Temperature Range: -55℃~+155℃
R43 = 0402WGF8201TCE: LCSC Part Name: 8.2kΩ ±1% 62.5mW 厚膜电阻; Supplier Part: C25924; Manufacturer: UNI-ROYAL(厚声); Supplier Footprint: 0402; JLCPCB Part Class: Extended Part; Datasheet: https://item.szlcsc.com/datasheet/0402WGF8201TCE/26667.html; Supplier: LCSC; Type: Thick Film Resistor; Tolerance: ±1%; Power(Watts): 62.5mW; Voltage-Supply(Max): 50V; Temperature Coefficient: ±100ppm/℃; Operating Temperature: -55℃~+155℃
R44 = 0402WGJ0123TCE: LCSC Part Name: 12kΩ ±5% 62.5mW 厚膜电阻; Supplier Part: C25535; Manufacturer: UNI-ROYAL(厚声); Supplier Footprint: 0402; JLCPCB Part Class: Extended Part; Datasheet: https://item.szlcsc.com/datasheet/0402WGJ0123TCE/26278.html; Supplier: LCSC; Type: Thick Film Resistor; Tolerance: ±5%; Power(Watts): 62.5mW; Voltage-Supply(Max): 50V; Temperature Coefficient: ±100ppm/℃; Operating Temperature: -55℃~+155℃
R45 = 0402WGJ0183TCE: LCSC Part Name: 18kΩ ±5% 62.5mW 厚膜电阻; Supplier Part: C25542; Manufacturer: UNI-ROYAL(厚声); Supplier Footprint: 0402; JLCPCB Part Class: Extended Part; Datasheet: https://item.szlcsc.com/datasheet/0402WGJ0183TCE/26285.html; Supplier: LCSC; Type: Thick Film Resistor; Tolerance: ±5%; Power(Watts): 62.5mW; Voltage-Supply(Max): 50V; Temperature Coefficient: ±100ppm/℃; Operating Temperature: -55℃~+155℃
R46 = 0402WGF3302TCE: LCSC Part Name: 33kΩ ±1% 62.5mW 厚膜电阻; Supplier Part: C25779; Manufacturer: UNI-ROYAL(厚声); Supplier Footprint: 0402; JLCPCB Part Class: Basic Part; Datasheet: https://atta.szlcsc.com/upload/public/pdf/source/20200306/C422600_1E6D84923E4A46A82E41ADD87F860B5C.pdf; Supplier: LCSC; Type: Thick Film Resistors; Tolerance: ±1%; Temperature Coefficient: ±100ppm/℃; Operating Temperature Range: -55℃~+155℃
R47 = 0402WGF2401TCE: LCSC Part Name: 2.4kΩ ±1% 62.5mW 厚膜电阻; Supplier Part: C25882; Manufacturer: UNI-ROYAL(厚声); Supplier Footprint: 0402; JLCPCB Part Class: Extended Part; Datasheet: https://atta.szlcsc.com/upload/public/pdf/source/20200306/C422600_1E6D84923E4A46A82E41ADD87F860B5C.pdf; Supplier: LCSC; Type: Thick Film Resistors; Tolerance: ±1%; Temperature Coefficient: ±100ppm/℃; Operating Temperature Range: -55℃~+155℃
R60-R63 R69-R72 = 0402WGF220JTCE: LCSC Part Name: 22Ω ±1% 62.5mW 厚膜电阻; Supplier Part: C25092; Manufacturer: UNI-ROYAL(厚声); Supplier Footprint: 0402; JLCPCB Part Class: Basic Part; Datasheet: https://atta.szlcsc.com/upload/public/pdf/source/20200306/C422600_1E6D84923E4A46A82E41ADD87F860B5C.pdf; Supplier: LCSC; Type: Thick Film Resistors; Tolerance: ±1%; Temperature Coefficient: ±100ppm/℃; Operating Temperature Range: -55℃~+155℃
R64 = 0603WAF3002T5E: Type:Thick Film Resistors Resistance:30kΩ Tolerance:±1% Tolerance:±1% Power(Watts): Overload Voltage (Max): Temperature Coefficient:±100ppm/℃ Temperature Coefficient:±100ppm/℃ Operating Temperature Range:-55℃~+155℃ Operating Temperature Range:-55℃~+155℃; LCSC Part Name: 30kΩ ±1% 100mW 厚膜电阻; Supplier Part: C22984; Manufacturer: UNI-ROYAL(厚声); Supplier Footprint: 0603; JLCPCB Part Class: Basic Part; Datasheet: https://atta.szlcsc.com/upload/public/pdf/source/20200306/C422600_1E6D84923E4A46A82E41ADD87F860B5C.pdf; Supplier: LCSC; Type: Thick Film Resistors; Tolerance: ±1%; Temperature Coefficient: ±100ppm/℃; Operating Temperature Range: -55℃~+155℃
R65 R66 = 0805W8F0000T5E_C17477: LCSC Part Name: 0Ω ±1% 125mW 厚膜电阻; Supplier Part: C17477; Manufacturer: UNI-ROYAL(厚声); Manufacturer Part: 0805W8F0000T5E; Supplier Footprint: 0805; JLCPCB Part Class: Basic Part; Datasheet: https://item.szlcsc.com/datasheet/0805W8F0000T5E/18165.html; Supplier: LCSC; Type: Thick Film Resistor; Tolerance: ±1%; Power(Watts): 125mW; Voltage-Supply(Max): 150V; Temperature Coefficient: ±800ppm/℃; Operating Temperature: -55℃~+155℃
U12 = DRV8871DDAR: LCSC Part Name: 3.6A 有刷直流电机驱动芯片 5.5V; Supplier Part: C75864; Manufacturer: TI(德州仪器); Supplier Footprint: SO-8-EP; JLCPCB Part Class: Extended Part; Datasheet: https://www.ti.com/cn/lit/gpn/drv8871; Supplier: LCSC
U16 = ESP32-S3_1: LCSC Part Name: ESP32-S3-Nano开发板 搭载ESP32-S3R8 兼容Arduino Nano ESP32; Supplier Part: C22438991; Manufacturer: Waveshare(微雪电子); Datasheet: https://atta.szlcsc.com/upload/public/pdf/source/20240524/9AC4F764515A18F6425D65CB76AC3BC4.pdf; Supplier: LCSC
D1 = 1N4148WS_C2128: LCSC Part Name: 丝印T4 1N4148WS; Supplier Part: C2128; Manufacturer: CJ(江苏长电/长晶); Supplier Footprint: SOD-323; JLCPCB Part Class: Basic Part; Datasheet: https://item.szlcsc.com/datasheet/1N4148WS/2485.html; Supplier: LCSC; Diode Configuration: Independent; Voltage - Forward(Vf@If): 1.25V@150mA; Voltage - DC Reverse(Vr): 100V; Current - Rectified: 150mA; Pd - Power Dissipation: 200mW; Reverse Leakage Current (Ir): 1uA@75V; Reverse Recovery Time (trr): 4ns; Non-Repetitive Peak Forward Surge Current: 2A
D2 D3 = RCLAMP0521P-N: LCSC Part Name: 双向TVS 5V截止 峰值脉冲电流：3.5A@8/20us; Supplier Part: C316043; Manufacturer: BORN(伯恩半导体); Supplier Footprint: DFN1006-2; JLCPCB Part Class: Extended Part; Datasheet: https://item.szlcsc.com/datasheet/RCLAMP0521P-N/297731.html; Supplier: LCSC; Polarity: Bidirectional; Reverse Stand-Off Voltage (Vrwm): 5V; Clamping Voltage: 16V; Peak Pulse Current (Ipp): 3.5A@8/20us; Peak Pulse Power Dissipation (Ppp): 60W@8/20us; Voltage - Breakdown: 6V; Reverse Leakage Current (Ir): 500nA; Number of Channels: 1; level of protection: IEC 61000-4-4；IEC 61000-4-5；IEC 61000-4-2; Type: TVS; Junction Capacitance: 0.4pF
R29 = 0603WAF4701T5E: LCSC Part Name: 4.7kΩ ±1% 100mW 厚膜电阻; Supplier Part: C23162; Manufacturer: UNI-ROYAL(厚声); Supplier Footprint: 0603; JLCPCB Part Class: Basic Part; Datasheet: https://item.szlcsc.com/datasheet/0603WAF4701T5E/23889.html; Supplier: LCSC; Type: Thick Film Resistor; Tolerance: ±1%; Power(Watts): 100mW; Voltage-Supply(Max): 75V; Temperature Coefficient: ±100ppm/℃; Operating Temperature: -55℃~+155℃
R31 = 0603WAF2200T5E: LCSC Part Name: 220Ω ±1% 100mW 厚膜电阻; Supplier Part: C22962; Manufacturer: UNI-ROYAL(厚声); Supplier Footprint: 0603; JLCPCB Part Class: Basic Part; Datasheet: https://atta.szlcsc.com/upload/public/pdf/source/20200306/C422600_1E6D84923E4A46A82E41ADD87F860B5C.pdf; Supplier: LCSC; Type: Thick Film Resistors; Tolerance: ±1%; Temperature Coefficient: ±100ppm/℃; Operating Temperature Range: -55℃~+155℃
R32 = 0603WAF1004T5E: LCSC Part Name: 1MΩ ±1% 100mW 厚膜电阻; Supplier Part: C22935; Manufacturer: UNI-ROYAL(厚声); Supplier Footprint: 0603; JLCPCB Part Class: Basic Part; Datasheet: https://atta.szlcsc.com/upload/public/pdf/source/20200306/C422600_1E6D84923E4A46A82E41ADD87F860B5C.pdf; Supplier: LCSC; Type: Thick Film Resistors; Tolerance: ±1%; Temperature Coefficient: ±100ppm/℃; Operating Temperature Range: -55℃~+155℃
U15 = 6N137S1(TA): LCSC Part Name: DC输入 1通道 隔离电压(rms):5000V; Supplier Part: C110020; Manufacturer: EVERLIGHT(亿光); Supplier Footprint: SOP-8-2.54mm; JLCPCB Part Class: Extended Part; Supplier: LCSC; Input Type: DC; Voltage - Supply: 4.5V~5.5V; Isolation Voltage(Vrms): 5kV; CMTI(kV/us): 10kV/us; Data Rate: 10Mbps; Number of Channels: 1; Operating Temperature: -40℃~+85℃; Low level Delay Time: 75ns; High level Delay Time: 75ns; Input threshold current: 5mA; power dissipation: 100mW; Voltage - Forward(Vf): 1.4V
C81 = CL05B103KB5NNNC: LCSC Part Name: 10nF ±10% 50V; Supplier Part: C15195; Manufacturer: SAMSUNG(三星); Supplier Footprint: 0402; JLCPCB Part Class: Basic Part; Datasheet: https://item.szlcsc.com/datasheet/CL05B103KB5NNNC/15869.html; Supplier: LCSC; Tolerance: ±10%; Voltage Rating: 50V; Temperature Coefficient: X7R
C84-C86 = ERS1HM471G20OT: LCSC Part Name: 470uF ±20% 50V; Supplier Part: C106666; Manufacturer: AISHI(艾华集团); Supplier Footprint: 插件,D10xL20mm; JLCPCB Part Class: Extended Part; Datasheet: https://atta.szlcsc.com/upload/public/pdf/source/20191015/C438940_4B8E60A742BB0AE40DDEF87A5C89089D.pdf; Supplier: LCSC; Tolerance: ±20%; Lifetime @ Temp: 7000hrs@105℃
CN7 = DB142V-5.08-2P-GN: LCSC Part Name: 1x2P 5.08mm 每排P数:2 排数:1; Supplier Part: C2898699; Manufacturer: DORABO(地博电气); Supplier Footprint: 插件,P=5.08mm; JLCPCB Part Class: Extended Part; Datasheet: https://item.szlcsc.com/datasheet/DB142V-5.08-2P-GN/3146278.html; Supplier: LCSC; Number of Positions or Pins: 1x2P; Pitch: 5.08mm; Color: Green; Mounting Type: Through Hole; Number of Pins: 2P; Number of PINs Per Row: 2; Number of Rows: 1; Current Rating: 10A; Voltage Rating (Max): 300V; Wire Gauge - AWG: 14~24; Wire Gauge - mm2: 1.5; Operating Temperature: -40℃~+105℃
D6 = SMBJ30CA-AT/TR13: Supplier Part: C2926817; Manufacturer: Brightking(君耀电子); Supplier Footprint: SMB(DO-214AA); JLCPCB Part Class: Extended Part; Datasheet: https://item.szlcsc.com/datasheet/SMBJ30CA-AT%252FTR13/3251493.html; Supplier: LCSC; Reverse Stand-Off Voltage (Vrwm): 30V; Clamping Voltage: 48.4V; Peak Pulse Current (Ipp): 12.4A; Peak Pulse Power Dissipation (Ppp): 600W; Voltage - Breakdown: 33.3V; Reverse Leakage Current (Ir): 1uA; Type: TVS
F1 = 1812L150/33GR: LCSC Part Name: 33V 1.5A 自恢复保险丝; Supplier Part: C18198333; Manufacturer: LUTE(陆特); Supplier Footprint: 1812; JLCPCB Part Class: Extended Part; Datasheet: https://item.szlcsc.com/datasheet/1812L150%252F33GR/19349727.html; Supplier: LCSC; Voltage - Max: 33V; Current - Max: 40A; Hold Current: 1.5A; Trip Current: 3A; Power Dissipation: 1.2W; Resistance - Initial (Ri) (Min): 40mΩ; Resistance - Post Trip (R1) (Max): 160mΩ; Time to Trip(Max): 500ms; Operating Temperature: -40℃~+85℃; Length: 4.73mm; Width: 3.41mm; Height: 1.5mm
L6 L7 = BLM21PG221SN1D: LCSC Part Name: 单路 0805磁珠 阻抗220Ω@100MHz; Supplier Part: C85840; Manufacturer: muRata(村田); Supplier Footprint: 0805; JLCPCB Part Class: Extended Part; Datasheet: https://atta.szlcsc.com/upload/public/pdf/source/20180326/C118443_3FAC30E9A4F0E6B81275543C61E0685E.pdf; Supplier: LCSC; Impedance @ Frequency: 220Ω@100MHz; Tolerance: ±25%; DC Resistance: 45mΩ; Current Rating: 2A; Circuits: 1
L14 = FXL0630-6R8-M: LCSC Part Name: 6.8uH ±20% 6A; Supplier Part: C167221; Manufacturer: cjiang(长江微电); Supplier Footprint: SMD,7x6.6mm; JLCPCB Part Class: Extended Part; Datasheet: https://item.szlcsc.com/datasheet/FXL0630-6R8-M/178604.html; Supplier: LCSC; Tolerance: ±20%; Current Rating: 5A; Current - Saturation(Isat): 6A; DC Resistance(DCR): 48mΩ; Type: Molded Inductor
R37 = 0402WGF5602TCE: LCSC Part Name: 56kΩ ±1% 62.5mW 厚膜电阻; Supplier Part: C25796; Manufacturer: UNI-ROYAL(厚声); Supplier Footprint: 0402; JLCPCB Part Class: Extended Part; Datasheet: https://item.szlcsc.com/datasheet/0402WGF5602TCE/26539.html; Supplier: LCSC; Type: Thick Film Resistor; Tolerance: ±1%; Power(Watts): 62.5mW; Voltage-Supply(Max): 50V; Temperature Coefficient: ±100ppm/℃; Operating Temperature: -55℃~+155℃
U17 = EUP3458VIR1: LCSC Part Name: 1.2A连续负载30V输入1.2MHz降压转换器; Supplier Part: C89300; Manufacturer: EUTECH(德信); Supplier Footprint: SOT-23-6; JLCPCB Part Class: Extended Part; Datasheet: https://atta.szlcsc.com/upload/public/pdf/source/20170620/1497944879969.pdf; Supplier: LCSC; Function: Step-down type; Voltage - Supply: 4.5V~30V; Output Voltage: 800mV~15V; Output Current: 1.2A; Frequency - Switching: 1.2MHz; Operating Temperature: -40℃~+85℃; Number of Outputs: 1; Topology: Step-down; Switch tube (built-in/external): Built-in

## Nets
2V5A: C43.2 C44.2 C46.1 C50.1 R7.2 R9.1 R13.2 R14.1 R21.2 U2.2(VOCM) U6.2(VOCM)
3V3: C8.1 C22.1 C28.1 C29.1 C30.1 C32.1 C87.1 C102.2 C105.2 CARD1.4(VDD) CN20.2 CN21.2 CN32.2 CN36.2 L1.1 R29.2 R38.2 R48.1 R49.1 R54.1 R55.1 R56.1 R57.1 R58.1 R59.1 R73.1 U1.17(XSMT) U1.20(DVDD) U14.5(OUT)
3V3A: C12.2 C14.1 C24.1 C25.2 C73.1 L11.2 U1.1(CPVDD) U1.8(AVDD)
3V3ESP: C92.2 R68.2 U16.17(3V3)
5V: C26.1 C27.1 C65.1 C71.2 C75.1 C86.1 C90.1 C103.1 C104.1 CN30.2 CN31.2 CN34.2 CN35.2 D7.2(A) L2.1 L7.1 U14.1(IN) U14.3(EN) U15.7(VE) U15.8(VCC)
5V_P: C59.1 C82.1 C84.1 C91.1 CN25.2 CN26.2 L6.2 L14.2 R37.2 R66.2
5VA: C39.1 C40.1 C41.1 C42.2 C47.1 C48.2 C51.1 C52.2 C68.1 L9.1 R3.2 R5.2 R12.2 U2.3(V+) U3.5(V+) U6.3(V+)
GND: C7.1 C8.2 C12.1 C14.2 C15.1 C18.2 C19.1 C21.1 C22.2 C23.1 C24.2 C25.1 C26.2 C27.2 C28.2 C29.2 C30.2 C32.2 C34.2 C37.2 C39.2 C40.2 C41.2 C42.1 C43.1 C44.1 C46.2 C47.2 C48.1 C50.2 C51.2 C52.1 C59.2 C63.2 C65.2 C68.2 C69.1 C71.1 C72.1 C73.2 C74.2 C75.2 C80.2 C82.2 C84.2 C85.2 C86.2 C87.2 C88.1 C89.1 C90.2 C91.2 C92.1 C102.1 C103.2 C104.2 C105.1 CARD1.6(VSS) CARD1.10(GND) CARD1.11(GND) CARD1.12(GND) CARD1.13(GND) CN3.2 CN4.1 CN5.1 CN7.2 CN8.2 CN9.2 CN10.2 CN11.2 CN12.2 CN13.2 CN14.2 CN15.2 CN16.2 CN17.2 CN22.2 CN25.1 CN26.1 CN30.1 CN31.1 CN32.1 CN34.1 CN35.1 CN36.1 D4.2(A) D5.2(A) D6.1 R4.1 R11.2 R16.2 R19.2 R20.1 R24.2 R25.1 R36.1 R52.2 R53.2 R64.1 R67.2 U1.3(CPGND) U1.9(AGND) U1.10(DEMP) U1.11(FLT) U1.16(FMT) U1.19(DGND) U2.6(V-) U3.2(V-) U6.6(V-) U7.2 U8.1 U9.2 U10.1 U12.1(GND) U12.7(PGND) U12.9(EP) U14.2(GND) U15.5(GND) U16.4(GND) U16.29(GND) U16.31(EH) U16.32(EH) U16.33(EH) U16.34(EH) U17.2(GND)
VIN: C80.1 C85.1 D5.1(K) D6.2 F1.2 R65.2 U17.4(EN) U17.5(IN)
BCK: CN33.2 R62.1 U1.13(BCK)
BIN: CN33.3 R63.1 U1.14(DIN)
BUTTONS: CN8.1 R38.1 R39.1 R40.1 R41.1 R42.1 R43.1 R44.1 R45.1 R46.1 R47.1 U16.21(A2)
DAC_OUT_L: C19.2 C110.1 R2.2 R16.1 R34.1
DAC_OUT_R: C18.1 C106.1 R1.2 R11.1 R33.1
DISP_BOOT_SCL: CN29.2 CN32.4 CN36.4 R73.2 U16.22(A3)
DISP_RST: CN29.1 U16.9(D6)
DISP_RX: CN22.1 U16.2(RX1)
DISP_TX: CN22.3 U16.1(TX1)
ENC1_A: CN30.4 R48.2 U16.5(D2)
ENC1_B: CN30.3 R49.2 U16.6(D3)
ENC2_A: CN31.4 R54.2 U16.7(D4)
ENC2_B: CN31.3 R55.2 U16.8(D5)
LRCK: CN33.4 R61.1 U1.15(LRCK)
MIDI+: CN6.3 D3.2 L12.1
MIDI-: CN6.1 D2.2 L13.1
MIDI-GND: C77.1 D2.1 D3.1 R32.1
MIDI-SHLD: C77.2 CN6.2 R32.2
MIDI_RX: R29.1 U15.6(VOUT) U16.12(D9)
MOT_1: U12.3(IN1) U16.10(D7)
MOT_2: U12.2(IN2) U16.11(D8)
POTI1: CN20.1 R52.1 U16.19(A0)
POTI2: CN21.1 R53.1 U16.20(A1)
SCK: CN33.1 R60.1 U1.12(SCK)
SD_CS: CARD1.2(CDDAT3(CS)) R57.2 R72.2
SD_MISO: R56.2 R70.1 U16.15(D12)
SD_MOSI: CARD1.3(CMD(DI)) R58.2 R71.2
SD_SCK: CARD1.5(CLK(SCLK)) R59.2 R69.1
SERVO1: CN25.3 R67.1 U16.18(B0)
SERVO2_SDA: CN26.3 CN32.3 CN36.3 R68.1 U16.28(B1)
VOUT+_L: R15.2 R22.1 U6.4(VOUT+)
VOUT+_R: R8.1 R10.2 U2.4(VOUT+)
VOUT-_L: R23.1 R74.1 U6.5(VOUT-)
VOUT-_R: R18.1 R75.2 U2.5(VOUT-)
$1N1407: C7.2 C21.2 U1.18(LDOO)
$1N1935: C15.2 C23.2 U1.5(VNEG)
$1N2008: C16.1 U1.2(CAPP)
$1N2014: C16.2 U1.4(CAPM)
$1N2221: R1.1 U1.7(OUTR)
$1N2225: R2.1 U1.6(OUTL)
$1N3304: C34.1 L10.1 L11.1
$1N3850: C69.2 R3.1 R4.2 U3.3(IN+)
$1N4507: R5.1 U2.7(Enable)
$1N4717: R6.1 R7.1 R75.1 U2.8(VIN+)
$1N5036: R9.2 R10.1 U2.1(VIN-)
$1N5767: R12.1 U6.7(Enable)
$1N5781: R13.1 R17.1 R74.2 U6.8(VIN+)
$1N5788: R14.2 R15.1 U6.1(VIN-)
$1N6509: C111.2 CN4.3 R19.1 U7.1
$1N6548: C107.2 CN4.2 R20.2 U8.2
$1N7374: C112.2 CN5.3 R24.1 U9.1
$1N7378: C113.2 CN5.2 R25.2 U10.2
$1N10090: C72.2 L2.2 L9.2
$1N10332: C74.1 L1.2 L10.2
$1N13339: C108.2 CN3.1
$1N13344: C109.2 CN3.3
$1N19455: C109.1 R33.2
$1N19459: C108.1 R34.2
$1N19581: C106.2 R6.2
$1N24964: R21.1 U3.1(OUT) U3.4(IN-)
$1N33664: C110.2 R17.2
$1N33672: C111.1 R8.2
$1N33674: C107.1 R18.2
$1N33676: C112.1 R22.2
$1N33681: C113.1 R23.2
$2N918: C63.1 L6.1 L7.2
$2N4325: C81.2 U17.1(BS)
$2N4366: C81.1 D4.1(K) L14.1 U17.6(SW)
$2N4745: R36.2 R37.1 U17.3(FB)
$2N5209: CN7.1 F1.1
$3N1707: D1.1(K) R31.2 U15.2(AN)
$3N1715: D1.2(A) L13.2 U15.3(CAT)
$3N1862: L12.2 R31.1
$4N1617: CN11.1 R47.2
$4N1679: CN12.1 R41.2
$4N1741: CN13.1 R42.2
$4N1803: CN14.1 R43.2
$4N1865: CN15.1 R44.2
$4N1927: CN16.1 R45.2
$4N1989: CN17.1 R46.2
$4N2006: CN10.1 R40.2
$4N2009: CN9.1 R39.2
$4N2912: R62.2 U16.25(A6)
$4N2931: R60.2 U16.23(A4)
$4N2944: R63.2 U16.26(A7)
$4N2957: R61.2 U16.24(A5)
$4N2969: R69.2 U16.16(D13)
$4N2975: R71.1 U16.14(D11)
$4N2978: R72.1 U16.13(D10)
$4N3425: CARD1.7(DAT0(D0)) R70.2
$4N4375: CN24.2 U12.8(OUT2)
$4N4376: CN24.1 U12.6(OUT1)
$4N4381: R64.2 U12.4(ILIM)
$4N4382: C37.1 R65.1 R66.1 U12.5(VM)
$4N7943: C88.2 C89.2 D7.1(K) U16.30(VIN)

Not connected (* = marked no-connect by the designer): CARD1 1(DAT2(RSV)) 8(DAT1(RSV)) 9(CD); U14 4(NC); U15 1(NC) 4(NC); U16 3(RST)* 27(VBUS)*

## Notes on the sheets
sheet 4
- 30K --> 2A
